# EAGLE design teleinfokit (EAGLE 9.6.2)
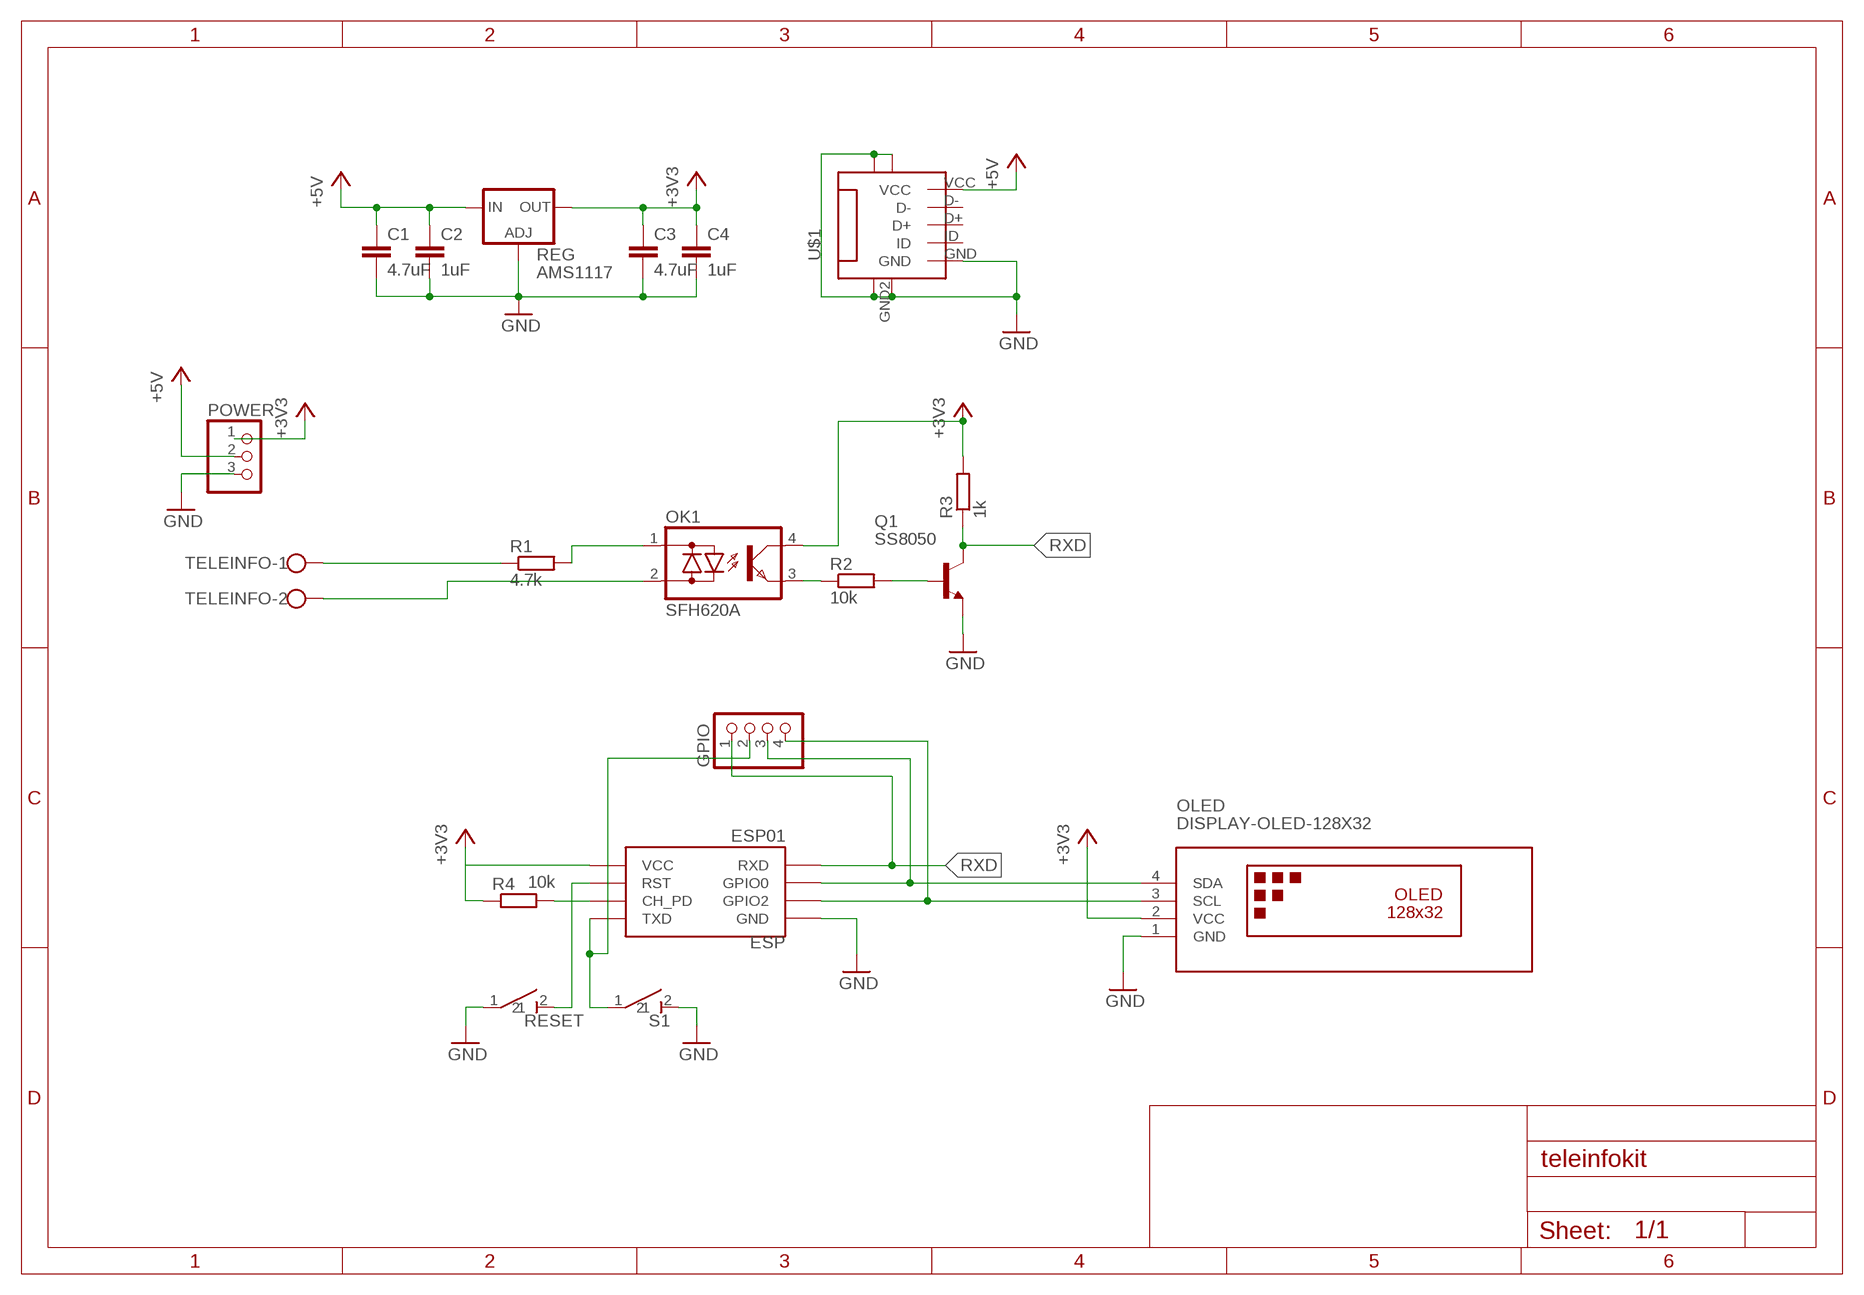
[diagram p0: schematic, sheet 1]

## Parts
C1  4.7uF  C-EUC0805  [C0805]
C2  1uF  C-EUC0805  [C0805]
C3  4.7uF  C-EUC0805  [C0805]
C4  1uF  C-EUC0805  [C0805]
ESP  ESP01  [ESP01]
GPIO  PINHD-1X4  [1X04]
OK1  SFH620A  [DIL04]
OLED  DISPLAY-OLED-128X32  [DISPLAY-OLED-128X32]
POWER  PINHD-1X3  [1X03]
Q1  SS8050  BC850SMD  [SOT23-BEC]
R1  4.7k  R-EU_R0805  [R0805]
R2  10k  R-EU_R0805  [R0805]
R3  1k  R-EU_R0805  [R0805]
R4  10k  R-EU_R0805  [R0805]
REG  AMS1117  LD117AS33TR  [SOT223]
RESET  MICROSWITCH  [MICROSWITCH]
S1  MICROSWITCH  [MICROSWITCH]
TELEINFO  W237-102  [W237-102]
U$1  USB_MICRO_SMD  [USB_MICRO_SMD]

## Nets
+3V3: C3.1 C4.1 ESP.VCC OK1.4(C) OLED.2(VCC) POWER.1 R3.2 R4.1 REG.4(OUT)
+5V: C1.1 C2.1 POWER.2 REG.3(IN) U$1.VCC
GND: C1.2 C2.2 C3.2 C4.2 ESP.GND OLED.1(GND) POWER.3 Q1.E REG.1(ADJ) RESET.1 S1.2 U$1.GND U$1.GND1 U$1.GND2 U$1.GND3 U$1.GND4
N$1: OK1.1(AC1) R1.2
N$2: ESP.GPIO0 GPIO.3 OLED.4(SDA)
N$4: ESP.TX(TXD) GPIO.2 S1.1
N$5: Q1.B R2.2
N$6: ESP.GPIO2 GPIO.4 OLED.3(SCL)
N$7: R1.1 TELEINFO.1
N$8: OK1.2(AC2) TELEINFO.2
N$9: ESP.CH_PD R4.2
N$10: ESP.RST RESET.2
N$11: OK1.3(E) R2.1
RXD: ESP.RX(RXD) GPIO.1 Q1.C R3.1
Unconnected: U$1.D+ U$1.D- U$1.ID

## Library data of the parts
C1 C3 = rcl:C-EU: CAPACITOR, European symbol; LCSC_PART: C1779; SPICEPREFIX: C
C2 C4 = rcl:C-EU: CAPACITOR, European symbol; LCSC_PART: C28323; SPICEPREFIX: C
ESP = esp8266modules-edit:ESP01: ESP8266 Wifi module 01
GPIO = pinhead:PINHD-1X4: PIN HEADER
OK1 = optocoupler:SFH620: Optocoupler, Phototransistor Output, AC Input Source: http://www.vishay.com/docs/83675/sfh620.pdf; MPN: SFH620A-2; OC_FARNELL: 1469594; OC_NEWARK: 97K9546
OLED = oled-edit:DISPLAY-OLED-128X32: 128x32 Dot Matrix OLED Module with I2C interface based on SSD1306 chip More details available here: http://www.tinyosshop.com/index.php?route=product/product&product_id=953 Schematic available here: http://www.tinyosshop.com/datasheet/OLED%2012832.pdf SSD1306 datasheet: https://cdn-shop.adafruit.com/datasheets/SSD1306.pdf Click here to find device on ebay.com <http://www.ebay.com/sch/oled+display+128x32+i2c>
POWER = pinhead:PINHD-1X3: PIN HEADER
Q1 = transistor-npn:BC850*: NPN Transistor; LCSC_PART: C2150
R1 = rcl:R-EU_: RESISTOR, European symbol; LCSC_PART: C17673; SPICEPREFIX: R
R2 R4 = rcl:R-EU_: RESISTOR, European symbol; LCSC_PART: C17414; SPICEPREFIX: R
R3 = rcl:R-EU_: RESISTOR, European symbol; LCSC_PART: C17513; SPICEPREFIX: R
REG = v-reg:LD117A?*: Low drop fixed and adjustable positive voltage regulators 1 A Source: http://www.st.com/stonline/products/literature/ds/7194/ld1117axx.pdf; LCSC_PART: C6186
RESET S1 = Nicolas:MICROSWITCH: basic microswitch
TELEINFO = con-wago-500:W237-102: WAGO SCREW CLAMP; MPN: 237-102; OC_FARNELL: unknown; OC_NEWARK: 70K9898
U$1 = Nicolas:USB_MICRO_SMD; LCSC_PART: C145783

## Board
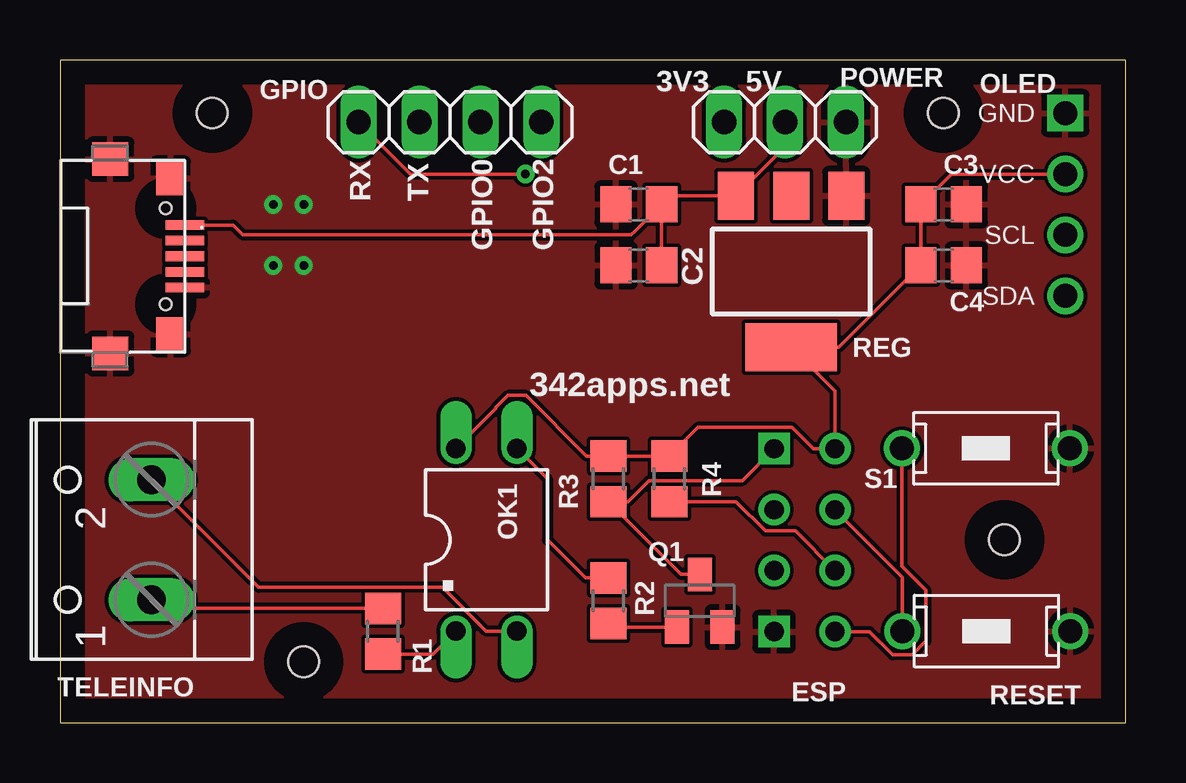
[diagram p1: board, top side]
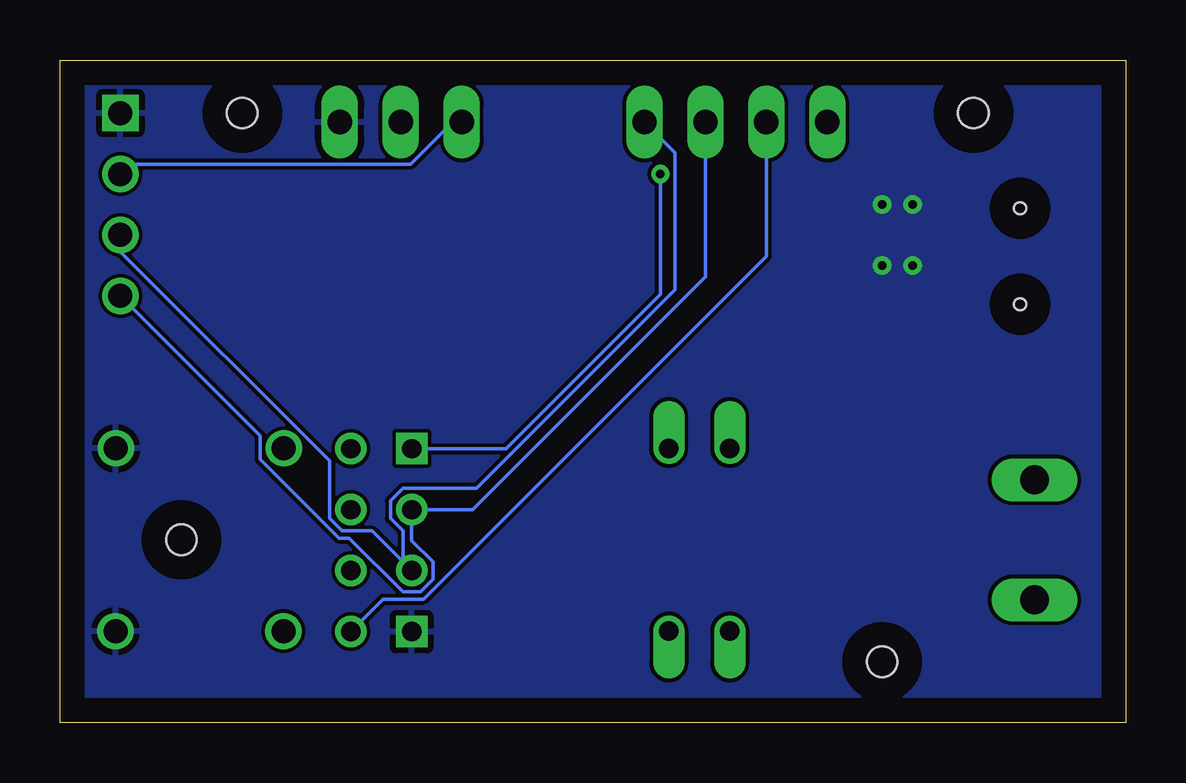
[diagram p2: board, bottom side, seen from below]

Size 44.43 x 27.61 mm. Coordinates in mm from the lower left corner, seen from the top.
Outline: 0,0 44.43,0 44.43,27.61 0,27.61 0,0
Copper layers (1*16): Top 0.035mm / dielectric 1.5mm / Bottom 0.035mm
Design rules "default": minimum track width 6mil, minimum drill 0.35mm, track to track 6mil, track to pad 6mil, pad to pad 6mil, via to via 6mil, smd to smd 6mil, copper to edge 40mil, drill to drill 6mil, minimum pad ring 10mil, minimum via ring 8mil, stop-mask expansion 4mil, vias tented up to drill 0mil, thermal gap 10mil
Holes 1.27 mm at 6.35,25.4 10.16,2.54 39.37,7.62 36.83,25.4

### Footprints (pad centres in the part's own frame; a part is rotated, then mirrored left to right if it is on the bottom)
C0805 = smd 1.3 x 1.5: 1 -0.95,0; 2 0.95,0
ESP01 = drill 0.8: CH_PD -1.285,-8.178; GPIO0 1.255,-5.638; GPIO2 -1.285,-5.638; RST 1.255,-8.178; TX -3.825,-8.178; VCC 3.795,-8.178 | drill 0.8 square: GND -3.825,-5.638; RX 3.795,-5.638
1X04 = drill 1.016 long: 1 -3.81,0; 2 -1.27,0; 3 1.27,0; 4 3.81,0
DIL04 = drill 0.813 offset: 1 -1.27,-3.81; 2 1.27,-3.81; 3 1.27,3.81; 4 -1.27,3.81
DISPLAY-OLED-128X32 = drill 1 square: 1 -17.78,-3.81 | drill 1: 2 -17.78,-1.27; 3 -17.78,1.27; 4 -17.78,3.81
1X03 = drill 1.016 long: 1 -2.54,0; 2 0,0; 3 2.54,0
SOT23-BEC = smd 1 x 1.4: B -0.95,-1.1; C 0,1.1; E 0.95,-1.1
R0805 = smd 1.3 x 1.5: 1 -0.95,0; 2 0.95,0
SOT223 = smd 1.5 x 2: 1 -2.3,-3.15; 2 0,-3.15; 3 2.3,-3.15 | smd 3.8 x 2: 4 0,3.15
MICROSWITCH = drill 1: 1 -3,0; 2 4,0
W237-102 = drill 1.194 long: 1 -2.5,-1.27; 2 2.5,-1.27
USB_MICRO_SMD = smd 0.4 x 1.6: D+ 0,0; D- 0.65,0; GND -1.3,0; ID -0.65,0; VCC 1.3,0 | smd 1.4 x 1.5: GND1 -4.05,3.11; GND4 4.05,3.11 | smd 1.4 x 1.2: GND2 -3.25,0.6; GND3 3.25,0.6 | hole 0.5: -2,0.8; 2,0.8

### Placement (x,y rotation side)
C1  24.13,21.59 180 top
C2  24.13,19.05 180 top
C3  36.83,21.59 0 top
C4  36.83,19.05 0 top
ESP  24.13,7.62 90 top
GPIO  16.26,25.02 0 top
OK1  17.78,7.62 0 top
OLED  24.13,21.59 180 top
POWER  30.23,25.02 0 top
Q1  26.67,5.08 0 top
R1  13.46,3.81 270 top
R2  22.86,5.08 270 top
R3  22.86,10.16 90 top
R4  25.4,10.16 270 top
REG  30.48,18.8 180 top
RESET  39.12,3.81 180 top
S1  38.1,11.43 0 top
TELEINFO  2.54,7.62 90 top
U$1  5.21,19.43 90 top

### Tracks (layer width: path | path; a pad name or v marks a point on that pad's centre or on a via)
+3V3
  Top 0.152: OK1.4 18.16,13.08 18.16,13.12 18.68,13.64 19.42,13.64 21.95,11.11 R3.2 R4.1 26.59,12.3 30.52,12.3 31.4,11.41 ESP.VCC 32.31,13.82 REG.4 32.48,15.65 C4.1 C3.1 37.15,22.86 OLED.2
  Bottom 0.152: POWER.1 28.06,25.02 29.82,23.27 41.5,23.27 OLED.2
+5V
  Top 0.152: C2.1 C1.1 | C1.1 25.44,21.95 REG.3 30.23,23.99 POWER.2 | C1.1 23.97,20.48 23.81,20.32 7.62,20.32 7.21,20.73 U$1.VCC
GND  (via drill 0.35)
  other vias: 8.89,21.59 10.16,21.59 8.89,19.05 10.16,19.05
  pour Bottom: 0,27.94 44.45,27.94 44.45,0 0,0
  pour Top: 0,27.94 44.45,27.94 44.45,0 0,0
N$1
  Top 0.152: R1.2 15.56,2.86 OK1.1
N$2
  Bottom 0.152: OLED.4 36.08,11.95 36.08,10.97 32.8,7.69 32.37,7.69 30.13,5.45 29.4,5.45 28.89,5.97 28.89,6.7 29.77,7.58 ESP.GPIO0 27.23,8.88 17.53,18.58 GPIO.3
N$4
  Top 0.152: S1.1 35.1,6.51 36.1,5.51 36.1,3.4 35.52,2.83 34.71,2.83 33.74,3.79 ESP.TX
  Bottom 0.152: ESP.TX 30.95,5.15 29.28,5.15 14.99,19.44 GPIO.2
N$5
  Top 0.152: R2.2 23.01,3.98 Q1.B
N$6
  Bottom 0.152: 30.13,6.7 31.43,7.99 32.67,7.99 33.19,8.51 33.19,10.91 41.91,19.63 OLED.3 | 30.13,6.7 ESP.GPIO2 | GPIO.4 18.8,23.75 18.8,18.03 27.07,9.76 30.13,9.76 30.65,9.24 30.65,8.51 30.13,7.99 30.13,6.7
N$7
  Top 0.152: R1.1 4.17,4.76 TELEINFO.1
N$8
  Top 0.152: OK1.2 17.77,3.81 15.94,5.64 8.29,5.64 TELEINFO.2
N$9
  Top 0.152: R4.2 28.18,9.21 29.4,7.99 30.65,7.99 ESP.CH_PD
N$10
  Top 0.152: RESET.2 35.12,6.07 ESP.RST
N$11
  Top 0.152: OK1.3 20.32,10.16 20.32,7.62 21.91,6.03 R2.1
RXD  (via drill 0.35)
  Top 0.152: Q1.C 25.89,6.18 R3.1 23.68,9.21 24.55,10.09 28.44,10.09 ESP.RX | v19.4,22.86 14.61,22.86 GPIO.1
  Bottom 0.152: ESP.RX 25.85,11.41 19.4,17.86 v19.4,22.86

### Text on the board
tNames: GPIO | 3V3 | 5V | POWER | OLED | C1 | C3 | RX | TX | GPIO0 | GPIO2 | C4 | 342apps.net | REG | S1 | R3 | R4 | OK1 | Q1 | . | R2 | TELEINFO | R1 | ESP | RESET